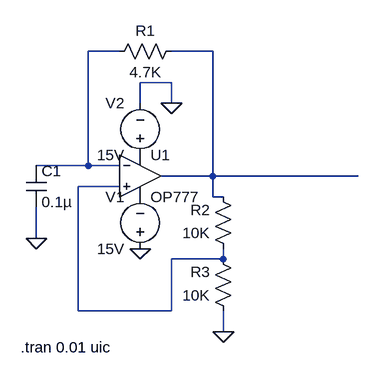
[diagram p0: schematic 3 Astable Multivibrator using opamp.asc]
3 Astable Multivibrator using opamp.asc, the LTspice schematic file:
Version 4
SHEET 1 880 680
WIRE 160 -32 112 -32
WIRE 304 -32 240 -32
WIRE 240 16 192 16
WIRE 192 48 192 16
WIRE 240 48 240 16
WIRE 112 144 112 -32
WIRE 112 144 32 144
WIRE 160 144 112 144
WIRE 304 160 304 -32
WIRE 304 160 224 160
WIRE 528 160 304 160
WIRE 160 176 96 176
WIRE 304 192 304 160
WIRE 320 192 304 192
WIRE 32 256 32 208
WIRE 320 288 320 272
WIRE 320 288 240 288
WIRE 96 368 96 176
WIRE 240 368 240 288
WIRE 240 368 96 368
WIRE 320 400 320 368
FLAG 32 256 0
FLAG 320 400 0
FLAG 192 272 0
FLAG 240 48 0
SYMBOL OpAmps\\OP777 192 96 R0
SYMATTR InstName U1
SYMBOL res 336 288 R180
WINDOW 0 36 76 Left 2
WINDOW 3 36 40 Left 2
SYMATTR InstName R2
SYMATTR Value 10K
SYMBOL res 336 384 R180
WINDOW 0 36 76 Left 2
WINDOW 3 36 40 Left 2
SYMATTR InstName R3
SYMATTR Value 10K
SYMBOL voltage 192 288 R180
WINDOW 0 24 96 Left 2
WINDOW 3 24 16 Left 2
WINDOW 123 0 0 Left 0
WINDOW 39 0 0 Left 0
SYMATTR InstName V1
SYMATTR Value 15V
SYMBOL voltage 192 144 R180
WINDOW 0 24 96 Left 2
WINDOW 3 24 16 Left 2
WINDOW 123 0 0 Left 0
WINDOW 39 0 0 Left 0
SYMATTR InstName V2
SYMATTR Value 15V
SYMBOL res 256 -48 R90
WINDOW 0 0 56 VBottom 2
WINDOW 3 32 56 VTop 2
SYMATTR InstName R1
SYMATTR Value 4.7K
SYMBOL cap 16 144 R0
SYMATTR InstName C1
SYMATTR Value 0.1µ
TEXT 8 424 Left 2 !.tran 0.01 uic

The netlist it stands for:
* 3 Astable Multivibrator using opamp.asc
XU1 N003 N001 P001 P002 N002 OP777  ; pins In+ In- V+ V- OUT
R2 N003 N002 10K
R3 0 N003 10K
V1 0 P002 15V
V2 P001 0 15V
R1 N002 N001 4.7K
C1 N001 0 0.1µ
.tran 0.01 uic
.lib ADI.lib
.backanno
.end